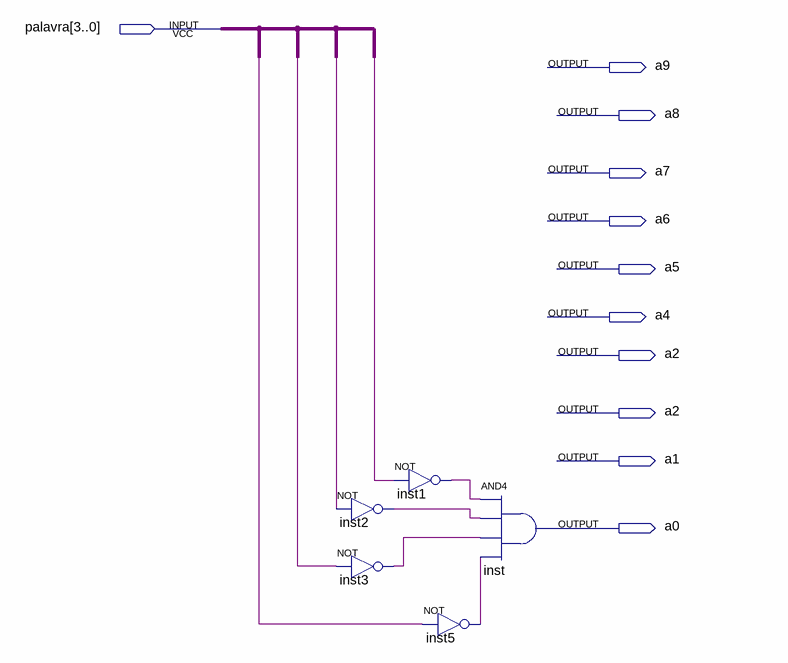
[diagram p0: schematic sheet]
// Quartus schematic codificador.bdf as structural Verilog: 5 symbols, 11 pins
module codificador (
  input  [3:0] palavra,
  output a9,
  output a8,
  output a7,
  output a6,
  output a5,
  output a4,
  output a2,
  output a1,
  output a0
);

  wire inst1_out, inst2_out, inst3_out, inst5_out, undriven, undriven_2, undriven_3, undriven_4;

  not inst2 (inst2_out, undriven);
  not inst3 (inst3_out, undriven_3);
  not inst1 (inst1_out, undriven_4);
  not inst5 (inst5_out, undriven_2);
  and inst (a0, inst1_out, inst2_out, inst3_out, inst5_out);
endmodule
